# Altium schematic sheet TopLevel.SchDoc
size Tabloid; DocumentNumber: 1; Revision: 1; SheetNumber: 1; SheetTotal: 11; SheetName: Top level; Size: 11x17; Sheet_Name: TopLevel
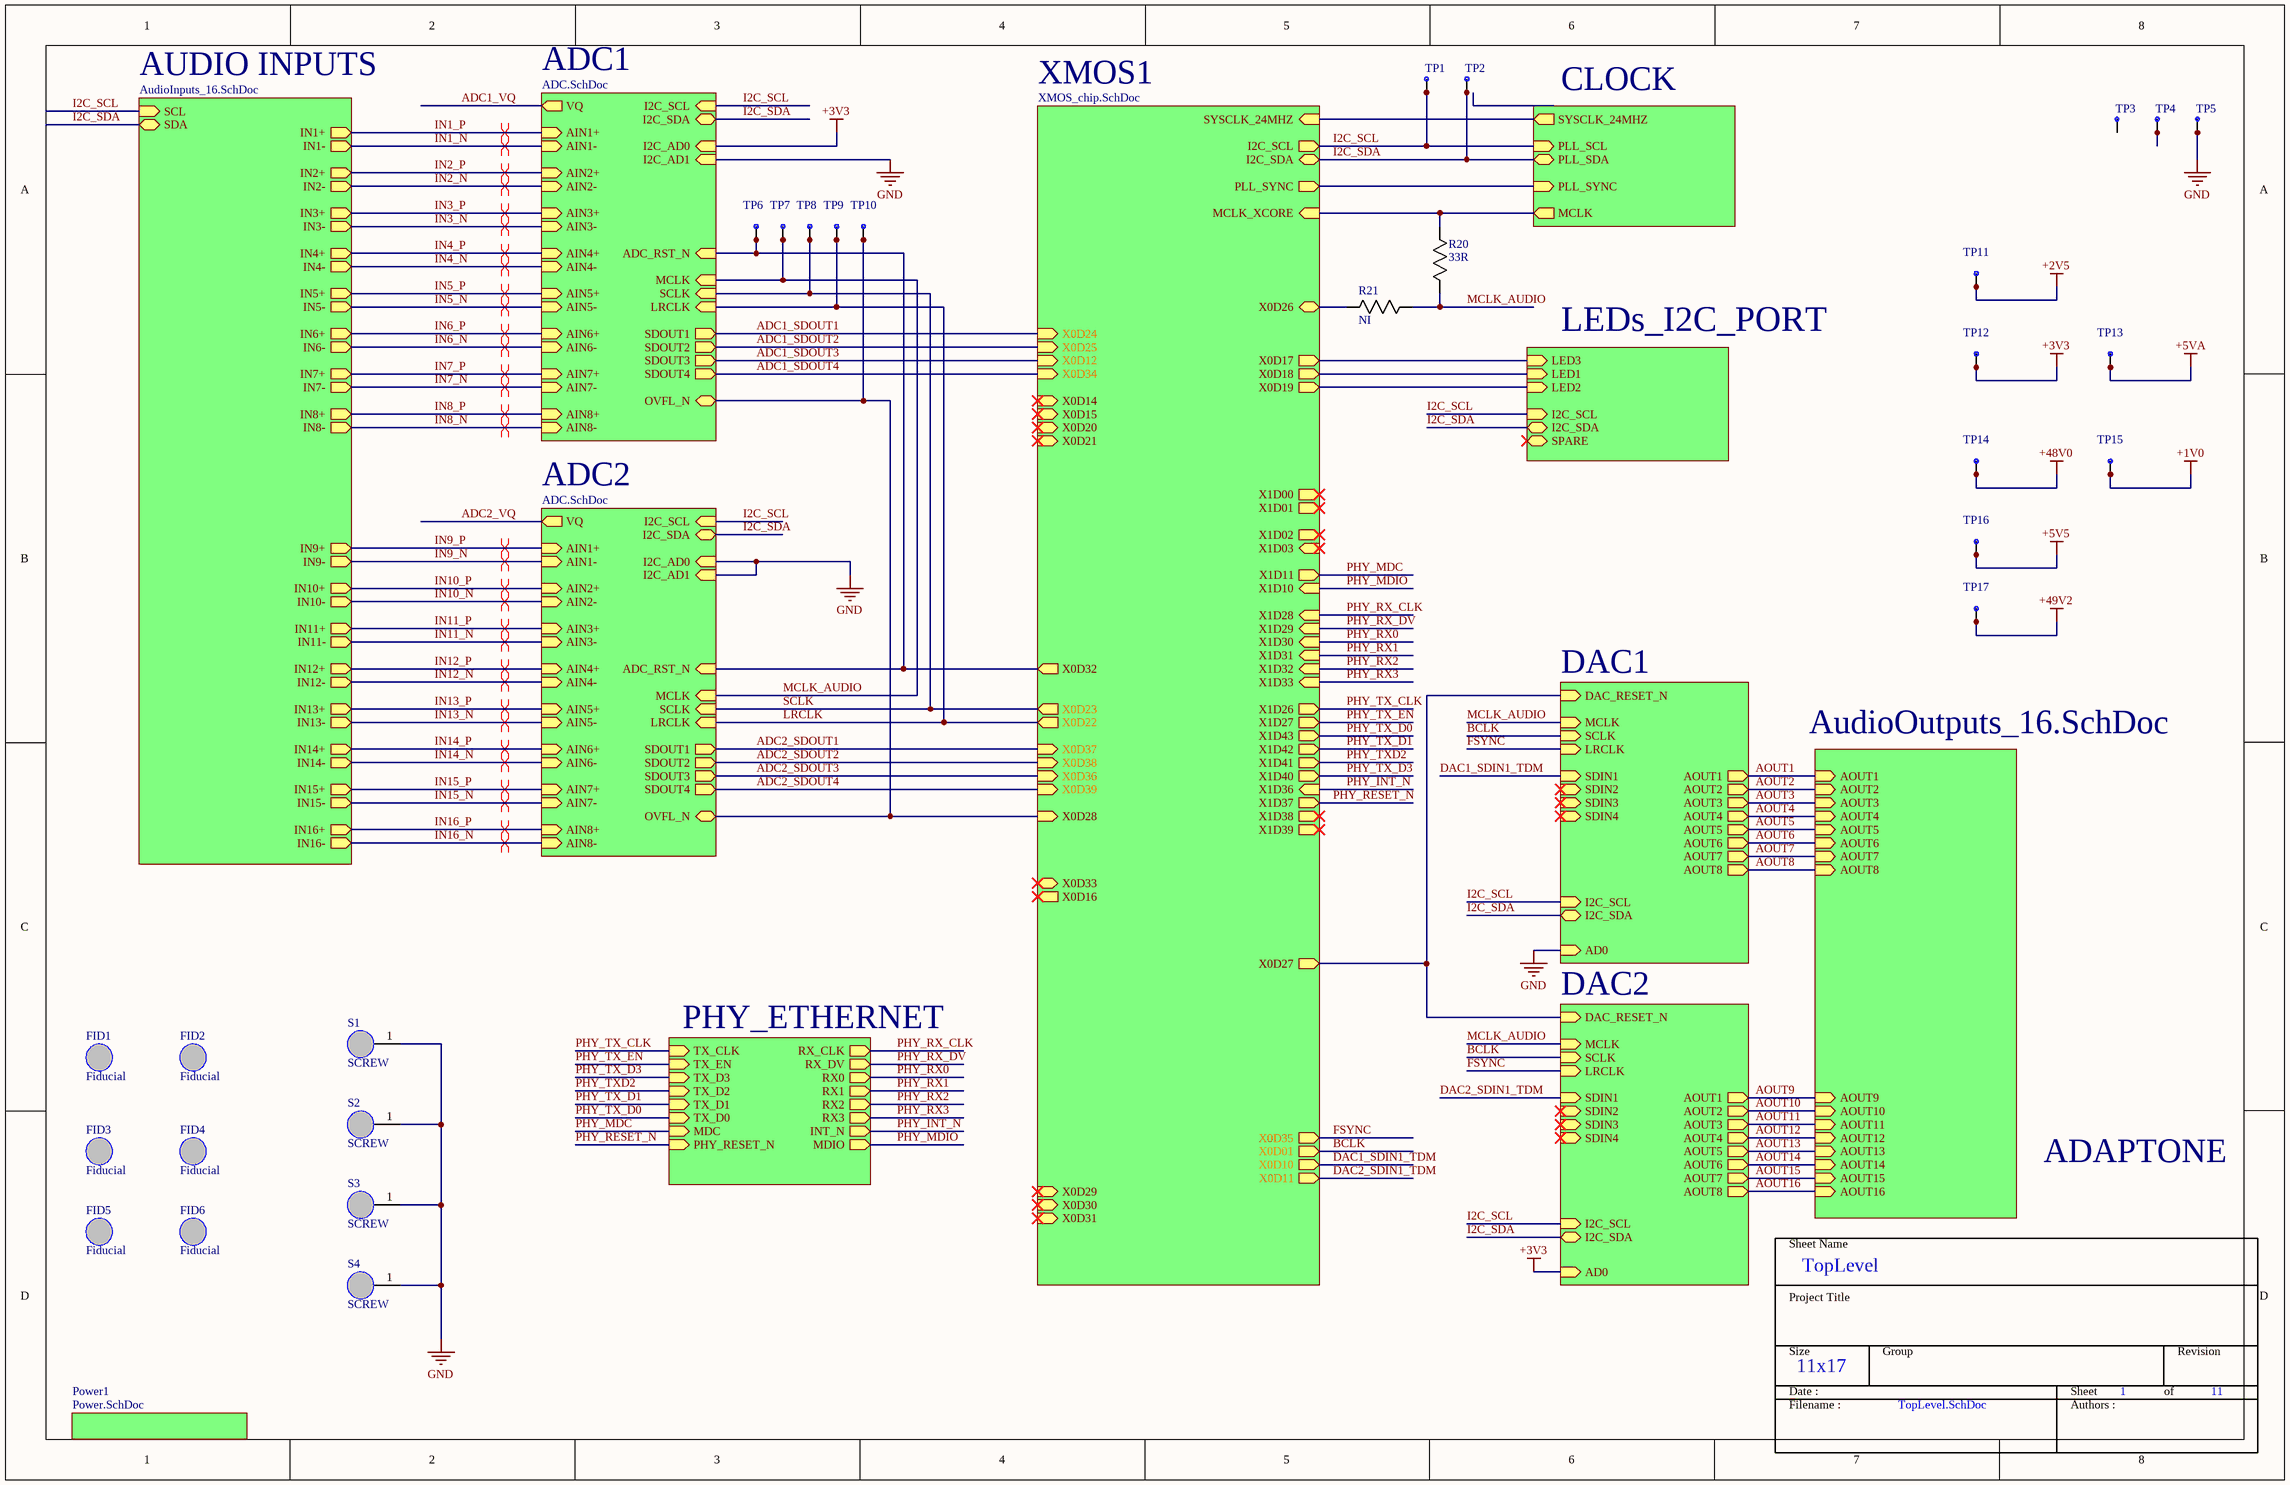
[diagram p0: TopLevel.SchDoc]

## Parts
FID1  Fiducial  [FIDUCIAL]
FID2  Fiducial  [FIDUCIAL]
FID3  Fiducial  [FIDUCIAL]
FID4  Fiducial  [FIDUCIAL]
FID5  Fiducial  [FIDUCIAL]
FID6  Fiducial  [FIDUCIAL]
R20  value 33R  [0603]  (hidden comment: Resistor)
R21  Resistor  [0603]  (value not drawn)
S1  SCREW  [SCREW_4_40]
S2  SCREW  [SCREW_4_40]
S3  SCREW  [SCREW_4_40]
S4  SCREW  [SCREW_4_40]
TP1  TESTPOINT  [0603]  (value not drawn)
TP2  TESTPOINT  [0603]  (value not drawn)
TP3  TESTPOINT  [0603]  (value not drawn)
TP4  TESTPOINT  [0603]  (value not drawn)
TP5  TESTPOINT  [0603]  (value not drawn)
TP6  TESTPOINT  [0603]  (value not drawn)
TP7  TESTPOINT  [0603]  (value not drawn)
TP8  TESTPOINT  [0603]  (value not drawn)
TP9  TESTPOINT  [0603]  (value not drawn)
TP10  TESTPOINT  [0603]  (value not drawn)
TP11  TESTPOINT  [0603]  (value not drawn)
TP12  TESTPOINT  [0603]  (value not drawn)
TP13  TESTPOINT  [0603]  (value not drawn)
TP14  TESTPOINT  [0603]  (value not drawn)
TP15  TESTPOINT  [0603]  (value not drawn)
TP16  TESTPOINT  [0603]  (value not drawn)
TP17  TESTPOINT  [0603]  (value not drawn)

## Sub-sheets
ADC1 = ADC.SchDoc: I2C_SCL (in), I2C_SDA (bidir), I2C_AD1 (in), I2C_AD0 (in), SDOUT1 (out), SDOUT2 (out), SDOUT3 (out), SDOUT4 (out), LRCLK (in), SCLK (in), MCLK (in), ADC_RST_N (in), OVFL_N (bidir), AIN1+ (in), AIN1- (in), AIN2+ (in), AIN2- (in), AIN3+ (in), AIN3- (in), AIN4+ (in), AIN4- (in), AIN5+ (in), AIN5- (in), AIN6+ (in), AIN6- (in), AIN7+ (in), AIN7- (in), AIN8+ (in), AIN8- (in), VQ (out)
ADC2 = ADC.SchDoc: I2C_SCL (in), I2C_SDA (bidir), I2C_AD1 (in), I2C_AD0 (in), SDOUT1 (out), SDOUT2 (out), SDOUT3 (out), SDOUT4 (out), LRCLK (in), SCLK (in), MCLK (in), ADC_RST_N (in), OVFL_N (bidir), AIN1+ (in), AIN1- (in), AIN2+ (in), AIN2- (in), AIN3+ (in), AIN3- (in), AIN4+ (in), AIN4- (in), AIN5+ (in), AIN5- (in), AIN6+ (in), AIN6- (in), AIN7+ (in), AIN7- (in), AIN8+ (in), AIN8- (in), VQ (out)
AUDIO INPUTS = AudioInputs_16.SchDoc: IN1+ (out), IN1- (out), IN2+ (out), IN2- (out), IN3+ (out), IN3- (out), IN4+ (out), IN4- (out), IN5+ (out), IN5- (out), IN6+ (out), IN6- (out), IN7+ (out), IN7- (out), IN8+ (out), IN8- (out), SCL (in), SDA (bidir), IN9+ (out), IN9- (out), IN10+ (out), IN10- (out), IN11+ (out), IN11- (out), IN12+ (out), IN12- (out), IN13+ (out), IN13- (out), IN14+ (out), IN14- (out), IN15+ (out), IN15- (out), IN16+ (out), IN16- (out)
CLOCK = Clock.SchDoc: SYSCLK_24MHZ (out), PLL_SYNC (in), PLL_SCL (in), PLL_SDA (bidir), MCLK (out)
DAC1 = DAC.SchDoc: LRCLK (in), SCLK (in), MCLK (in), SDIN1 (in), SDIN2 (in), SDIN3 (in), SDIN4 (in), DAC_RESET_N (in), I2C_SCL (in), I2C_SDA (bidir), AOUT1 (out), AOUT2 (out), AOUT3 (out), AOUT4 (out), AOUT5 (out), AOUT6 (out), AOUT7 (out), AOUT8 (out), AD0 (in)
DAC2 = DAC.SchDoc: LRCLK (in), SCLK (in), MCLK (in), SDIN1 (in), SDIN2 (in), SDIN3 (in), SDIN4 (in), DAC_RESET_N (in), I2C_SCL (in), I2C_SDA (bidir), AOUT1 (out), AOUT2 (out), AOUT3 (out), AOUT4 (out), AOUT5 (out), AOUT6 (out), AOUT7 (out), AOUT8 (out), AD0 (in)
LEDs_I2C_PORT = U_LEDs_I2C_PORT.SchDoc: LED3 (in), LED1 (in), LED2 (in), SPARE (bidir), I2C_SDA (bidir), I2C_SCL (in)
PHY_ETHERNET = PHY_ETHERNET.SchDoc: TX_CLK (in), TX_EN (in), RX_CLK (out), RX_DV (out), RX0 (out), RX1 (out), RX2 (out), RX3 (out), TX_D3 (in), TX_D2 (in), TX_D1 (in), TX_D0 (in), INT_N (out), MDIO (out), MDC (in), PHY_RESET_N (in)
Power1 = Power.SchDoc: no entries
U_AudioOutputs_16 = AudioOutputs_16.SchDoc: AOUT1 (in), AOUT2 (in), AOUT3 (in), AOUT4 (in), AOUT5 (in), AOUT6 (in), AOUT7 (in), AOUT8 (in), AOUT9 (in), AOUT10 (in), AOUT11 (in), AOUT12 (in), AOUT13 (in), AOUT14 (in), AOUT15 (in), AOUT16 (in)
XMOS1 = XMOS_chip.SchDoc: SYSCLK_24MHZ (in), MCLK_XCORE (in), I2C_SCL (out), I2C_SDA (bidir), PLL_SYNC (out), X0D14 (in), X0D15 (in), X0D16 (out), X0D17 (out), X0D18 (out), X0D19 (out), X0D20 (in), X0D21 (in), X0D22 (out), X0D23 (out), X0D24 (in), X0D25 (in), X0D27 (out), X0D32 (out), X0D34 (in), X0D35 (out), X0D36 (in), X0D37 (in), X0D38 (in), X0D39 (in), X0D29 (in), X0D28 (in), X0D31 (in), X0D30 (in), X0D33 (bidir), X0D26 (bidir), X1D26 (out), X1D27 (out), X1D28 (in), X1D29 (in), X1D30 (in), X1D31 (in), X1D32 (in), X1D33 (in), X1D43 (out), X1D42 (out), X1D41 (out), X1D40 (out), X1D10 (in), X1D11 (out), X1D03 (in), X1D02 (out), X1D01 (out), X1D00 (out), X1D37 (out), X1D36 (in), X1D39 (out), X1D38 (out), X0D12 (in), X0D11 (out), X0D01 (out), X0D10 (out)

## Nets
+1V0: TP15.1 TP15.2
+2V5: TP11.1 TP11.2
+3V3: TP12.1 TP12.2 ; sheet ADC1/I2C_AD0, sheet DAC2/AD0
+5V5: TP16.1 TP16.2
+5VA: TP13.1 TP13.2
+48V0: TP14.1 TP14.2
+49V2: TP17.1 TP17.2
GND: S1.1 S2.1 S3.1 S4.1 TP5.1 TP5.2 ; sheet ADC1/I2C_AD1, sheet DAC1/AD0, sheet ADC2/I2C_AD1, sheet ADC2/I2C_AD0
ADC1_SDOUT1: sheet XMOS1/X0D24, sheet ADC1/SDOUT1
ADC1_SDOUT2: sheet XMOS1/X0D25, sheet ADC1/SDOUT2
ADC1_SDOUT3: sheet XMOS1/X0D12, sheet ADC1/SDOUT3
ADC1_SDOUT4: sheet XMOS1/X0D34, sheet ADC1/SDOUT4
ADC1_VQ: sheet ADC1/VQ
ADC2_SDOUT1: sheet XMOS1/X0D37, sheet ADC2/SDOUT1
ADC2_SDOUT2: sheet XMOS1/X0D38, sheet ADC2/SDOUT2
ADC2_SDOUT3: sheet XMOS1/X0D36, sheet ADC2/SDOUT3
ADC2_SDOUT4: sheet XMOS1/X0D39, sheet ADC2/SDOUT4
ADC2_VQ: sheet ADC2/VQ
AOUT1: sheet DAC1/AOUT1, sheet U_AudioOutputs_16/AOUT1
AOUT2: sheet DAC1/AOUT2, sheet U_AudioOutputs_16/AOUT2
AOUT3: sheet DAC1/AOUT3, sheet U_AudioOutputs_16/AOUT3
AOUT4: sheet DAC1/AOUT4, sheet U_AudioOutputs_16/AOUT4
AOUT5: sheet DAC1/AOUT5, sheet U_AudioOutputs_16/AOUT5
AOUT6: sheet DAC1/AOUT6, sheet U_AudioOutputs_16/AOUT6
AOUT7: sheet DAC1/AOUT7, sheet U_AudioOutputs_16/AOUT7
AOUT8: sheet DAC1/AOUT8, sheet U_AudioOutputs_16/AOUT8
AOUT9: sheet DAC2/AOUT1, sheet U_AudioOutputs_16/AOUT9
AOUT10: sheet DAC2/AOUT2, sheet U_AudioOutputs_16/AOUT10
AOUT11: sheet DAC2/AOUT3, sheet U_AudioOutputs_16/AOUT11
AOUT12: sheet DAC2/AOUT4, sheet U_AudioOutputs_16/AOUT12
AOUT13: sheet DAC2/AOUT5, sheet U_AudioOutputs_16/AOUT13
AOUT14: sheet DAC2/AOUT6, sheet U_AudioOutputs_16/AOUT14
AOUT15: sheet DAC2/AOUT7, sheet U_AudioOutputs_16/AOUT15
AOUT16: sheet DAC2/AOUT8, sheet U_AudioOutputs_16/AOUT16
BCLK: sheet XMOS1/X0D01, sheet DAC2/SCLK, sheet DAC1/SCLK
DAC1_SDIN1_TDM: sheet XMOS1/X0D10, sheet DAC1/SDIN1
DAC2_SDIN1_TDM: sheet XMOS1/X0D11, sheet DAC2/SDIN1
FSYNC: sheet XMOS1/X0D35, sheet DAC2/LRCLK, sheet DAC1/LRCLK
I2C_SCL: TP1.1 TP1.2 ; sheet XMOS1/I2C_SCL, sheet CLOCK/PLL_SCL, sheet ADC1/I2C_SCL, sheet DAC2/I2C_SCL, sheet AUDIO INPUTS/SCL, sheet DAC1/I2C_SCL, sheet ADC2/I2C_SCL, sheet LEDs_I2C_PORT/I2C_SCL
I2C_SDA: TP2.1 TP2.2 ; sheet XMOS1/I2C_SDA, sheet CLOCK/PLL_SDA, sheet ADC1/I2C_SDA, sheet DAC2/I2C_SDA, sheet AUDIO INPUTS/SDA, sheet DAC1/I2C_SDA, sheet ADC2/I2C_SDA, sheet LEDs_I2C_PORT/I2C_SDA
IN1_N: sheet ADC1/AIN1-, sheet AUDIO INPUTS/IN1-
IN1_P: sheet ADC1/AIN1+, sheet AUDIO INPUTS/IN1+
IN2_N: sheet ADC1/AIN2-, sheet AUDIO INPUTS/IN2-
IN2_P: sheet ADC1/AIN2+, sheet AUDIO INPUTS/IN2+
IN3_N: sheet ADC1/AIN3-, sheet AUDIO INPUTS/IN3-
IN3_P: sheet ADC1/AIN3+, sheet AUDIO INPUTS/IN3+
IN4_N: sheet ADC1/AIN4-, sheet AUDIO INPUTS/IN4-
IN4_P: sheet ADC1/AIN4+, sheet AUDIO INPUTS/IN4+
IN5_N: sheet ADC1/AIN5-, sheet AUDIO INPUTS/IN5-
IN5_P: sheet ADC1/AIN5+, sheet AUDIO INPUTS/IN5+
IN6_N: sheet ADC1/AIN6-, sheet AUDIO INPUTS/IN6-
IN6_P: sheet ADC1/AIN6+, sheet AUDIO INPUTS/IN6+
IN7_N: sheet ADC1/AIN7-, sheet AUDIO INPUTS/IN7-
IN7_P: sheet ADC1/AIN7+, sheet AUDIO INPUTS/IN7+
IN8_N: sheet ADC1/AIN8-, sheet AUDIO INPUTS/IN8-
IN8_P: sheet ADC1/AIN8+, sheet AUDIO INPUTS/IN8+
IN9_N: sheet AUDIO INPUTS/IN9-, sheet ADC2/AIN1-
IN9_P: sheet AUDIO INPUTS/IN9+, sheet ADC2/AIN1+
IN10_N: sheet AUDIO INPUTS/IN10-, sheet ADC2/AIN2-
IN10_P: sheet AUDIO INPUTS/IN10+, sheet ADC2/AIN2+
IN11_N: sheet AUDIO INPUTS/IN11-, sheet ADC2/AIN3-
IN11_P: sheet AUDIO INPUTS/IN11+, sheet ADC2/AIN3+
IN12_N: sheet AUDIO INPUTS/IN12-, sheet ADC2/AIN4-
IN12_P: sheet AUDIO INPUTS/IN12+, sheet ADC2/AIN4+
IN13_N: sheet AUDIO INPUTS/IN13-, sheet ADC2/AIN5-
IN13_P: sheet AUDIO INPUTS/IN13+, sheet ADC2/AIN5+
IN14_N: sheet AUDIO INPUTS/IN14-, sheet ADC2/AIN6-
IN14_P: sheet AUDIO INPUTS/IN14+, sheet ADC2/AIN6+
IN15_N: sheet AUDIO INPUTS/IN15-, sheet ADC2/AIN7-
IN15_P: sheet AUDIO INPUTS/IN15+, sheet ADC2/AIN7+
IN16_N: sheet AUDIO INPUTS/IN16-, sheet ADC2/AIN8-
IN16_P: sheet AUDIO INPUTS/IN16+, sheet ADC2/AIN8+
LRCLK: TP9.1 TP9.2 ; sheet XMOS1/X0D22, sheet ADC1/LRCLK, sheet ADC2/LRCLK
MCLK_AUDIO: R20.1 R21.2 TP7.1 TP7.2 ; sheet ADC1/MCLK, sheet DAC2/MCLK, sheet DAC1/MCLK, sheet ADC2/MCLK
PHY_INT_N: sheet XMOS1/X1D36, sheet PHY_ETHERNET/INT_N
PHY_MDC: sheet XMOS1/X1D11, sheet PHY_ETHERNET/MDC
PHY_MDIO: sheet XMOS1/X1D10, sheet PHY_ETHERNET/MDIO
PHY_RESET_N: sheet XMOS1/X1D37, sheet PHY_ETHERNET/PHY_RESET_N
PHY_RX0: sheet XMOS1/X1D30, sheet PHY_ETHERNET/RX0
PHY_RX1: sheet XMOS1/X1D31, sheet PHY_ETHERNET/RX1
PHY_RX2: sheet XMOS1/X1D32, sheet PHY_ETHERNET/RX2
PHY_RX3: sheet XMOS1/X1D33, sheet PHY_ETHERNET/RX3
PHY_RX_CLK: sheet XMOS1/X1D28, sheet PHY_ETHERNET/RX_CLK
PHY_RX_DV: sheet XMOS1/X1D29, sheet PHY_ETHERNET/RX_DV
PHY_TX_CLK: sheet XMOS1/X1D26, sheet PHY_ETHERNET/TX_CLK
PHY_TX_D0: sheet XMOS1/X1D43, sheet PHY_ETHERNET/TX_D0
PHY_TX_D1: sheet XMOS1/X1D42, sheet PHY_ETHERNET/TX_D1
PHY_TX_D3: sheet XMOS1/X1D40, sheet PHY_ETHERNET/TX_D3
PHY_TX_EN: sheet XMOS1/X1D27, sheet PHY_ETHERNET/TX_EN
PHY_TXD2: sheet XMOS1/X1D41, sheet PHY_ETHERNET/TX_D2
SCLK: TP8.1 TP8.2 ; sheet XMOS1/X0D23, sheet ADC1/SCLK, sheet ADC2/SCLK
NetR20_2: R20.2 ; sheet XMOS1/MCLK_XCORE, sheet CLOCK/MCLK
NetR21_1: R21.1 ; sheet XMOS1/X0D26
NetTP3_1: TP3.1 TP3.2
NetTP4_1: TP4.1 TP4.2
NetTP6_1: TP6.1 TP6.2 ; sheet XMOS1/X0D32, sheet ADC1/ADC_RST_N, sheet ADC2/ADC_RST_N
NetTP10_1: TP10.1 TP10.2 ; sheet XMOS1/X0D28, sheet ADC1/OVFL_N, sheet ADC2/OVFL_N
(unnamed): sheet XMOS1/SYSCLK_24MHZ, sheet CLOCK/SYSCLK_24MHZ
(unnamed): sheet XMOS1/PLL_SYNC, sheet CLOCK/PLL_SYNC
(unnamed): sheet XMOS1/X0D17, sheet LEDs_I2C_PORT/LED3
(unnamed): sheet XMOS1/X0D18, sheet LEDs_I2C_PORT/LED1
(unnamed): sheet XMOS1/X0D19, sheet LEDs_I2C_PORT/LED2
(unnamed): sheet XMOS1/X0D27, sheet DAC2/DAC_RESET_N, sheet DAC1/DAC_RESET_N

Not connected (* = marked no-connect by the designer): FID1 0; FID2 0; FID3 0; FID4 0; FID5 0; FID6 0

## Layout directives
differential pair: IN1_N, IN1_P, IN2_N, IN2_P, IN3_N, IN3_P, IN4_N, IN4_P, IN5_N, IN5_P, IN6_N, IN6_P, IN7_N, IN7_P, IN8_N, IN8_P, IN9_N, IN9_P, IN10_N, IN10_P, IN11_N, IN11_P, IN12_N, IN12_P, IN13_N, IN13_P, IN14_N, IN14_P, IN15_N, IN15_P, IN16_N, IN16_P

## Notes on the sheet
- ADAPTONE
- Sheet Name
- Project Title
- Size
- Group
- Revision
- Date :
- Filename :
- Sheet
- Authors :
- of

## Library data of the parts
R20 = Resistor: Mfg: Yageo; Mfg_PN: RC0603JR-0733RL; HelpURL: *; NI: *; Supplier1: Digikey; Supplier1_PN: 311-33GRCT-ND; Type: *; Rating: *; Tolerance: *
R21 = Resistor: Mfg: Yageo; Mfg_PN: RC0603JR-0733RL; Value: 33R; HelpURL: *; NI: NI; Supplier1: Digikey; Supplier1_PN: 311-33GRCT-ND; Type: *; Rating: *; Tolerance: *
S1-S4 = SCREW: Screw hole; HelpURL: *; Mfg: *; Mfg_PN: *; NI: NI; Rating: *; Supplier1: *; Supplier1_PN: *; Tolerance: *; Type: *; Value: *
TP1 TP2 TP6-TP17 = TESTPOINT: Test point; Mfg: TE; Mfg_PN: RCU-0C; HelpURL: *; NI: *; Rating: *; Supplier1: Digikey; Supplier1_PN: A106145CT-ND; Tolerance: *; Type: *; Value: *
TP3-TP5 = TESTPOINT: Test point; Mfg: Harwin; Mfg_PN: S1751-46; HelpURL: *; NI: *; Rating: *; Supplier1: Digikey; Supplier1_PN: 952-3024-ND; Tolerance: *; Type: *; Value: *
FID1-FID6 = Fiducial: HelpURL: *; Mfg: *; Mfg_PN: *; NI: NI; Rating: *; Supplier1: *; Supplier1_PN: *; Tolerance: *; Type: *; Value: *